# EAGLE design PlatingBoard (EAGLE 7.3.0)
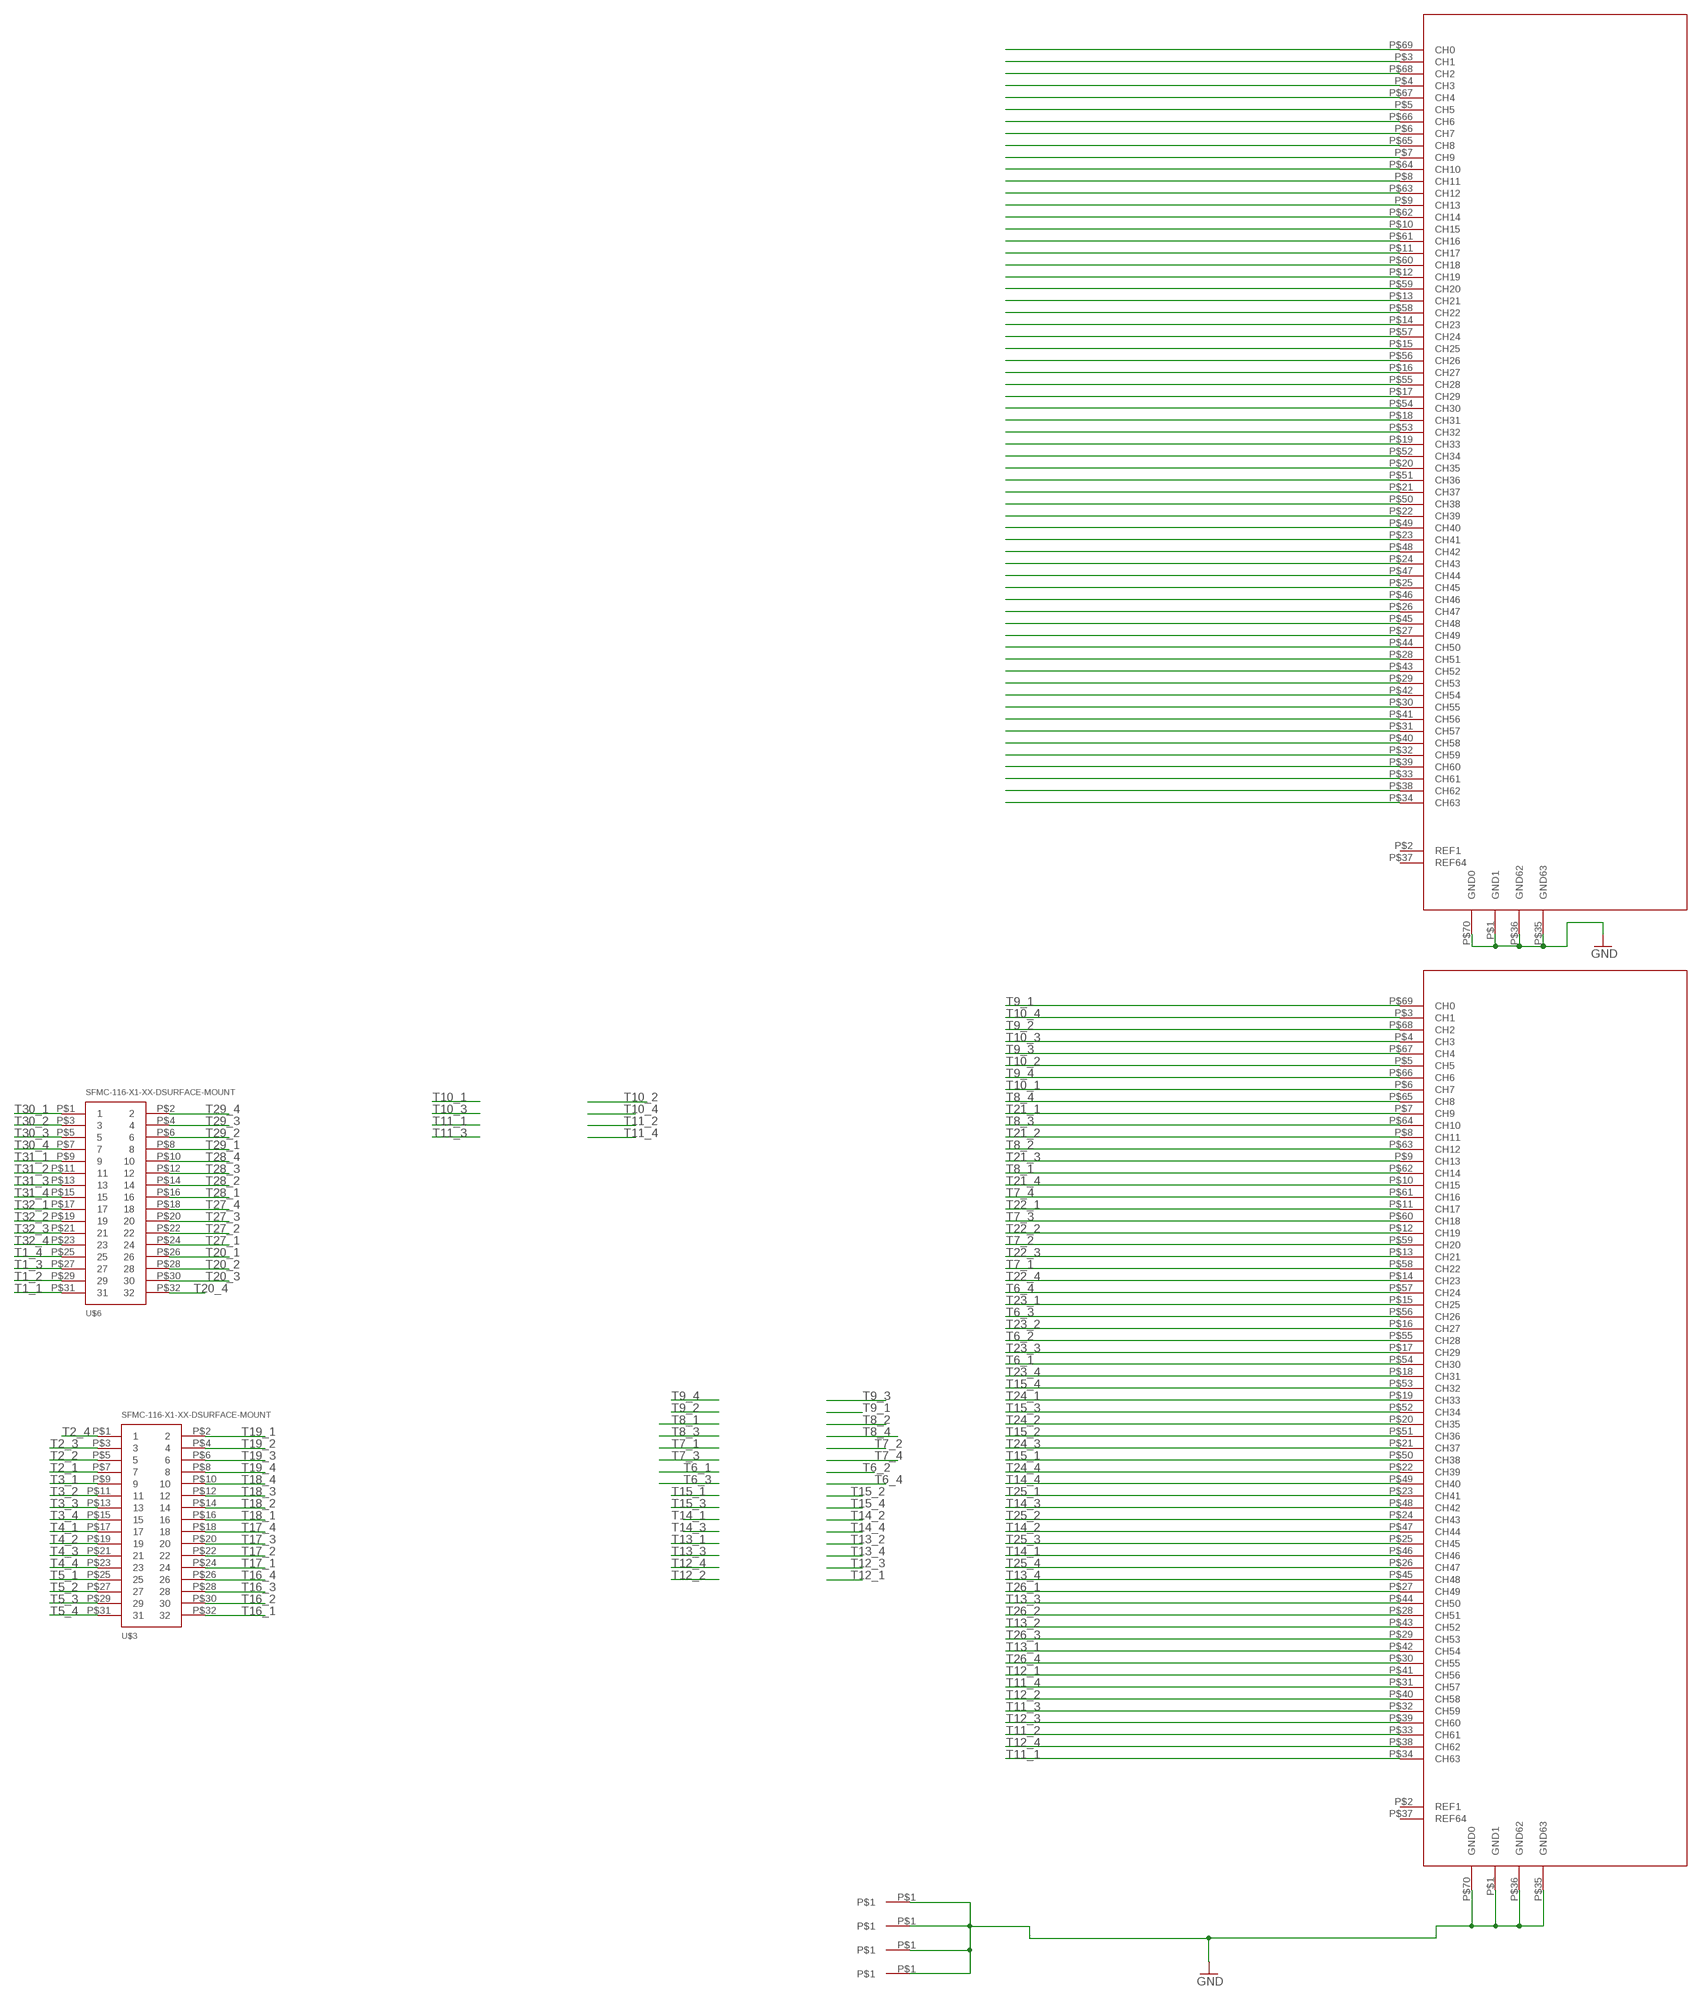
[diagram p0: schematic, sheet 1]

## Parts
U$1  TARRAYSHUTTLEHOLE  [TARRAYSHUTTLEHOLE]
U$2  TARRAYSHUTTLEHOLE  [TARRAYSHUTTLEHOLE]
U$3  SFMC-116-X1-XX-DSURFACE-MOUNT  [SFMC-116-X2-XX-D]
U$4  TARRAYSHUTTLEHOLE  [TARRAYSHUTTLEHOLE]
U$5  TARRAYSHUTTLEHOLE  [TARRAYSHUTTLEHOLE]
U$6  SFMC-116-X1-XX-DSURFACE-MOUNT  [SFMC-116-X2-XX-D]
U$11  HIROSE-70PIN-RECEPTACLE  [DF40HC-70DS-0.4V]
U$13  HIROSE-70PIN-RECEPTACLE  [DF40HC-70DS-0.4V]

## Nets
GND: U$1.P$1 U$2.P$1 U$4.P$1 U$5.P$1 U$11.P$1(GND1) U$11.P$35(GND63) U$11.P$36(GND62) U$11.P$70(GND0) U$13.P$1(GND1) U$13.P$35(GND63) U$13.P$36(GND62) U$13.P$70(GND0)
T1_1: U$6.P$31 U$11.P$34(CH63)
T1_2: U$6.P$29 U$11.P$33(CH61)
T1_3: U$6.P$27 U$11.P$32(CH59)
T1_4: U$6.P$25 U$11.P$31(CH57)
T2_1: U$3.P$7 U$11.P$41(CH56)
T2_2: U$3.P$5 U$11.P$40(CH58)
T2_3: U$3.P$3 U$11.P$39(CH60)
T2_4: U$3.P$1 U$11.P$38(CH62)
T3_1: U$3.P$9 U$11.P$42(CH54)
T3_2: U$3.P$11 U$11.P$43(CH52)
T3_3: U$3.P$13 U$11.P$44(CH50)
T3_4: U$3.P$15 U$11.P$45(CH48)
T4_1: U$3.P$17 U$11.P$46(CH46)
T4_2: U$3.P$19 U$11.P$47(CH44)
T4_3: U$3.P$21 U$11.P$48(CH42)
T4_4: U$3.P$23 U$11.P$49(CH40)
T5_1: U$3.P$25 U$11.P$50(CH38)
T5_2: U$3.P$27 U$11.P$51(CH36)
T5_3: U$3.P$29 U$11.P$52(CH34)
T5_4: U$3.P$31 U$11.P$53(CH32)
T6_1: U$13.P$54(CH30)
T6_2: U$13.P$55(CH28)
T6_3: U$13.P$56(CH26)
T6_4: U$13.P$57(CH24)
T7_1: U$13.P$58(CH22)
T7_2: U$13.P$59(CH20)
T7_3: U$13.P$60(CH18)
T7_4: U$13.P$61(CH16)
T8_1: U$13.P$62(CH14)
T8_2: U$13.P$63(CH12)
T8_3: U$13.P$64(CH10)
T8_4: U$13.P$65(CH8)
T9_1: U$13.P$69(CH0)
T9_2: U$13.P$68(CH2)
T9_3: U$13.P$67(CH4)
T9_4: U$13.P$66(CH6)
T10_1: U$13.P$6(CH7)
T10_2: U$13.P$5(CH5)
T10_3: U$13.P$4(CH3)
T10_4: U$13.P$3(CH1)
T11_1: U$13.P$34(CH63)
T11_2: U$13.P$33(CH61)
T11_3: U$13.P$32(CH59)
T11_4: U$13.P$31(CH57)
T12_1: U$13.P$41(CH56)
T12_2: U$13.P$40(CH58)
T12_3: U$13.P$39(CH60)
T12_4: U$13.P$38(CH62)
T13_1: U$13.P$42(CH54)
T13_2: U$13.P$43(CH52)
T13_3: U$13.P$44(CH50)
T13_4: U$13.P$45(CH48)
T14_1: U$13.P$46(CH46)
T14_2: U$13.P$47(CH44)
T14_3: U$13.P$48(CH42)
T14_4: U$13.P$49(CH40)
T15_1: U$13.P$50(CH38)
T15_2: U$13.P$51(CH36)
T15_3: U$13.P$52(CH34)
T15_4: U$13.P$53(CH32)
T16_1: U$3.P$32 U$11.P$54(CH30)
T16_2: U$3.P$30 U$11.P$55(CH28)
T16_3: U$3.P$28 U$11.P$56(CH26)
T16_4: U$3.P$26 U$11.P$57(CH24)
T17_1: U$3.P$24 U$11.P$58(CH22)
T17_2: U$3.P$22 U$11.P$59(CH20)
T17_3: U$3.P$20 U$11.P$60(CH18)
T17_4: U$3.P$18 U$11.P$61(CH16)
T18_1: U$3.P$16 U$11.P$62(CH14)
T18_2: U$3.P$14 U$11.P$63(CH12)
T18_3: U$3.P$12 U$11.P$64(CH10)
T18_4: U$3.P$10 U$11.P$65(CH8)
T19_1: U$3.P$2 U$11.P$69(CH0)
T19_2: U$3.P$4 U$11.P$68(CH2)
T19_3: U$3.P$6 U$11.P$67(CH4)
T19_4: U$3.P$8 U$11.P$66(CH6)
T20_1: U$6.P$26 U$11.P$6(CH7)
T20_2: U$6.P$28 U$11.P$5(CH5)
T20_3: U$6.P$30 U$11.P$4(CH3)
T20_4: U$6.P$32 U$11.P$3(CH1)
T21_1: U$13.P$7(CH9)
T21_2: U$13.P$8(CH11)
T21_3: U$13.P$9(CH13)
T21_4: U$13.P$10(CH15)
T22_1: U$13.P$11(CH17)
T22_2: U$13.P$12(CH19)
T22_3: U$13.P$13(CH21)
T22_4: U$13.P$14(CH23)
T23_1: U$13.P$15(CH25)
T23_2: U$13.P$16(CH27)
T23_3: U$13.P$17(CH29)
T23_4: U$13.P$18(CH31)
T24_1: U$13.P$19(CH33)
T24_2: U$13.P$20(CH35)
T24_3: U$13.P$21(CH37)
T24_4: U$13.P$22(CH39)
T25_1: U$13.P$23(CH41)
T25_2: U$13.P$24(CH43)
T25_3: U$13.P$25(CH45)
T25_4: U$13.P$26(CH47)
T26_1: U$13.P$27(CH49)
T26_2: U$13.P$28(CH51)
T26_3: U$13.P$29(CH53)
T26_4: U$13.P$30(CH55)
T27_1: U$6.P$24 U$11.P$7(CH9)
T27_2: U$6.P$22 U$11.P$8(CH11)
T27_3: U$6.P$20 U$11.P$9(CH13)
T27_4: U$6.P$18 U$11.P$10(CH15)
T28_1: U$6.P$16 U$11.P$11(CH17)
T28_2: U$6.P$14 U$11.P$12(CH19)
T28_3: U$6.P$12 U$11.P$13(CH21)
T28_4: U$6.P$10 U$11.P$14(CH23)
T29_1: U$6.P$8 U$11.P$15(CH25)
T29_2: U$6.P$6 U$11.P$16(CH27)
T29_3: U$6.P$4 U$11.P$17(CH29)
T29_4: U$6.P$2 U$11.P$18(CH31)
T30_1: U$6.P$1 U$11.P$19(CH33)
T30_2: U$6.P$3 U$11.P$20(CH35)
T30_3: U$6.P$5 U$11.P$21(CH37)
T30_4: U$6.P$7 U$11.P$22(CH39)
T31_1: U$6.P$9 U$11.P$23(CH41)
T31_2: U$6.P$11 U$11.P$24(CH43)
T31_3: U$6.P$13 U$11.P$25(CH45)
T31_4: U$6.P$15 U$11.P$26(CH47)
T32_1: U$6.P$17 U$11.P$27(CH49)
T32_2: U$6.P$19 U$11.P$28(CH51)
T32_3: U$6.P$21 U$11.P$29(CH53)
T32_4: U$6.P$23 U$11.P$30(CH55)
Unconnected: U$11.P$2(REF1) U$11.P$37(REF64) U$13.P$2(REF1) U$13.P$37(REF64)

## Library data of the parts
U$1 U$2 U$4 U$5 = UsefulConnectors:TARRAYSHUTTLEHOLE
U$3 U$6 = UsefulConnectors:SFMC-116-X1-XX-D
U$11 U$13 = UsefulConnectors:HIROSE-70PIN-RECEPTACLE

## Board
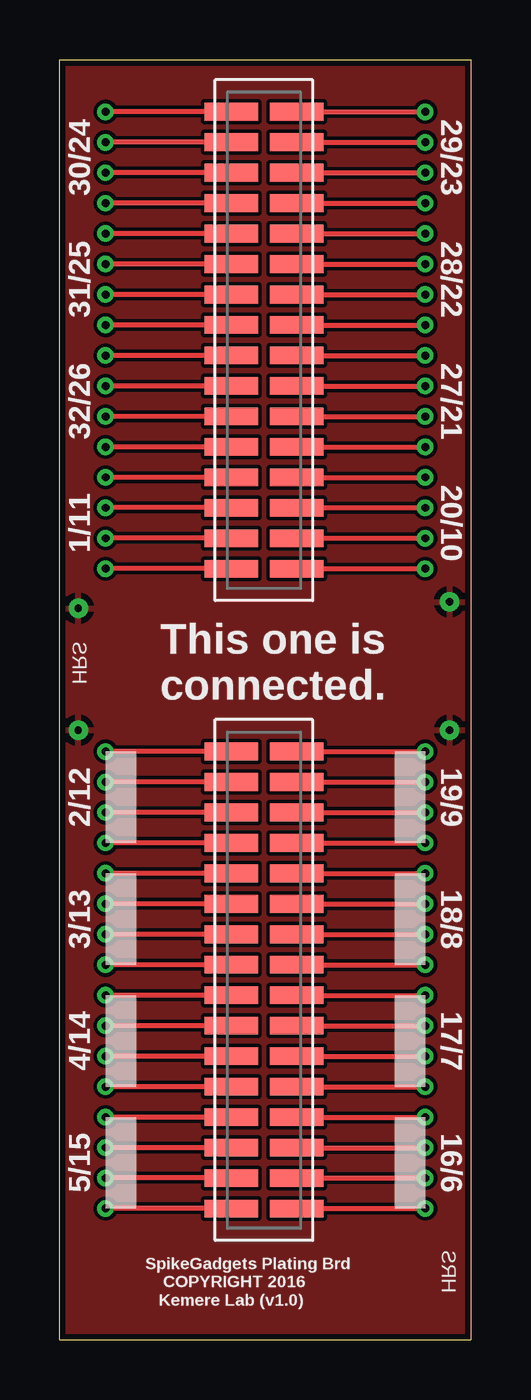
[diagram p1: board, top side]
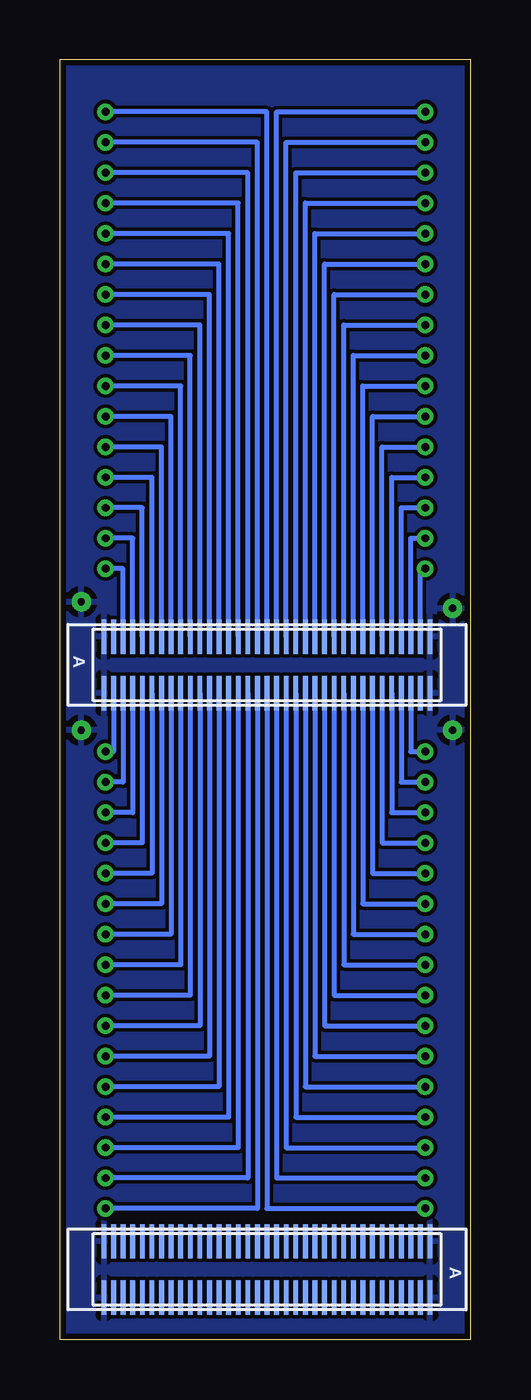
[diagram p2: board, bottom side, seen from below]

Size 17.14 x 53.34 mm. Coordinates in mm from the lower left corner, seen from the top.
Outline: 0,0 0,53.34 17.14,53.34 17.14,0 0,0
Copper layers (1*16): Top 0.035mm / dielectric 1.5mm / Bottom 0.035mm
Design rules "Seeed_DRU *": minimum track width 6mil, minimum drill 12mil, track to track 6mil, track to pad 6mil, pad to pad 6mil, via to via 6mil, smd to smd 0mil, copper to edge 10mil, drill to drill 10mil, minimum pad ring 10mil, minimum via ring 7mil, stop-mask expansion 2mil, vias tented up to drill 100mil, thermal gap 10mil

### Footprints (pad centres in the part's own frame; a part is rotated, then mirrored left to right if it is on the bottom)
TARRAYSHUTTLEHOLE = drill 0.305: P$1 0,0
SFMC-116-X2-XX-D = smd 0.737 x 2.223: P$1 9.525,1.365; P$2 9.525,-1.365; P$3 8.255,1.365; P$4 8.255,-1.365; P$5 6.985,1.365; P$6 6.985,-1.365; P$7 5.715,1.365; P$8 5.715,-1.365; P$9 4.445,1.365; P$10 4.445,-1.365; P$11 3.175,1.365; P$12 3.175,-1.365; P$13 1.905,1.365; P$14 1.905,-1.365; P$15 0.635,1.365; P$16 0.635,-1.365; P$17 -0.635,1.365; P$18 -0.635,-1.365; P$19 -1.905,1.365; P$20 -1.905,-1.365; P$21 -3.175,1.365; P$22 -3.175,-1.365; P$23 -4.445,1.365; P$24 -4.445,-1.365; P$25 -5.715,1.365; P$26 -5.715,-1.365; P$27 -6.985,1.365; P$28 -6.985,-1.365; P$29 -8.255,1.365; P$30 -8.255,-1.365; P$31 -9.525,1.365; P$32 -9.525,-1.365
DF40HC-70DS-0.4V = smd 0.2 x 1.43: P$1 -6.8,1.175; P$2 -6.4,1.175; P$3 -6,1.175; P$4 -5.6,1.175; P$5 -5.2,1.175; P$6 -4.8,1.175; P$7 -4.4,1.175; P$8 -4,1.175; P$9 -3.6,1.175; P$10 -3.2,1.175; P$11 -2.8,1.175; P$12 -2.4,1.175; P$13 -2,1.175; P$14 -1.6,1.175; P$15 -1.2,1.175; P$16 -0.8,1.175; P$17 -0.4,1.175; P$18 0,1.175; P$19 0.4,1.175; P$20 0.8,1.175; P$21 1.2,1.175; P$22 1.6,1.175; P$23 2,1.175; P$24 2.4,1.175; P$25 2.8,1.175; P$26 3.2,1.175; P$27 3.6,1.175; P$28 4,1.175; P$29 4.4,1.175; P$30 4.8,1.175; P$31 5.2,1.175; P$32 5.6,1.175; P$33 6,1.175; P$34 6.4,1.175; P$35 6.8,1.175; P$36 6.8,-1.175; P$37 6.4,-1.175; P$38 6,-1.175; P$39 5.6,-1.175; P$40 5.2,-1.175; P$41 4.8,-1.175; P$42 4.4,-1.175; P$43 4,-1.175; P$44 3.6,-1.175; P$45 3.2,-1.175; P$46 2.8,-1.175; P$47 2.4,-1.175; P$48 2,-1.175; P$49 1.6,-1.175; P$50 1.2,-1.175; P$51 0.8,-1.175; P$52 0.4,-1.175; P$53 0,-1.175; P$54 -0.4,-1.175; P$55 -0.8,-1.175; P$56 -1.2,-1.175; P$57 -1.6,-1.175; P$58 -2,-1.175; P$59 -2.4,-1.175; P$60 -2.8,-1.175; P$61 -3.2,-1.175; P$62 -3.6,-1.175; P$63 -4,-1.175; P$64 -4.4,-1.175; P$65 -4.8,-1.175; P$66 -5.2,-1.175; P$67 -5.6,-1.175; P$68 -6,-1.175; P$69 -6.4,-1.175; P$70 -6.8,-1.175

### Placement (x,y rotation side)
U$1  16.26,25.4 45 top
U$2  0.76,25.4 45 top
U$3  8.51,14.99 90 top
U$4  16.26,30.75 45 top
U$5  0.76,30.48 45 top
U$6  8.51,41.66 90 top
U$11  8.51,28.12 0 bottom
U$13  8.51,2.92 180 bottom

### Tracks (layer width: path | path; a pad name or v marks a point on that pad's centre or on a via)
GND
  pour Bottom: 0,0 17.02,0 17.02,53.47 0,53.47
  pour Top: 0,0 17.02,0 17.02,53.47 0,53.47
T1_1  (via drill 0.33)
  Top 0.203: U$6.P$31 v1.91,32.13
  Bottom 0.203: U$11.P$34 2.11,32.13 v1.91,32.13
T1_2  (via drill 0.33)
  Top 0.203: U$6.P$29 v1.91,33.4
  Bottom 0.203: U$11.P$33 2.51,33.4 v1.91,33.4
T1_3  (via drill 0.33)
  Top 0.203: U$6.P$27 v1.91,34.67
  Bottom 0.203: U$11.P$32 2.91,34.67 v1.91,34.67
T1_4  (via drill 0.33)
  Top 0.203: U$6.P$25 v1.91,35.94
  Bottom 0.203: U$11.P$31 3.31,35.94 v1.91,35.94
T2_1  (via drill 0.33)
  Top 0.203: U$3.P$7 v1.91,20.7
  Bottom 0.203: U$11.P$41 3.71,20.7 v1.91,20.7
T2_2  (via drill 0.33)
  Top 0.203: U$3.P$5 v1.91,21.97
  Bottom 0.203: U$11.P$40 3.31,21.97 v1.91,21.97
T2_3  (via drill 0.33)
  Top 0.203: U$3.P$3 v1.91,23.24
  Bottom 0.203: U$11.P$39 2.91,23.24 v1.91,23.24
T2_4  (via drill 0.33)
  Top 0.203: U$3.P$1 v1.91,24.51
  Bottom 0.203: U$11.P$38 2.51,24.51 v1.91,24.51
T3_1  (via drill 0.33)
  Top 0.203: U$3.P$9 v1.91,19.43
  Bottom 0.203: U$11.P$42 4.11,19.43 v1.91,19.43
T3_2  (via drill 0.33)
  Top 0.203: U$3.P$11 v1.91,18.16
  Bottom 0.203: U$11.P$43 4.51,18.16 v1.91,18.16
T3_3  (via drill 0.33)
  Top 0.203: U$3.P$13 v1.91,16.89
  Bottom 0.203: U$11.P$44 4.91,16.89 v1.91,16.89
T3_4  (via drill 0.33)
  Top 0.203: U$3.P$15 v1.91,15.62
  Bottom 0.203: U$11.P$45 5.31,15.62 v1.91,15.62
T4_1  (via drill 0.33)
  Top 0.203: U$3.P$17 v1.91,14.35
  Bottom 0.203: U$11.P$46 5.71,14.35 v1.91,14.35
T4_2  (via drill 0.33)
  Top 0.203: U$3.P$19 v1.91,13.08
  Bottom 0.203: U$11.P$47 6.11,13.08 v1.91,13.08
T4_3  (via drill 0.33)
  Top 0.203: U$3.P$21 v1.91,11.81
  Bottom 0.203: U$11.P$48 6.51,11.81 v1.91,11.81
T4_4  (via drill 0.33)
  Top 0.203: U$3.P$23 v1.91,10.54
  Bottom 0.203: U$11.P$49 6.91,10.54 v1.91,10.54
T5_1  (via drill 0.33)
  Top 0.203: U$3.P$25 v1.91,9.27
  Bottom 0.203: U$11.P$50 7.31,9.27 v1.91,9.27
T5_2  (via drill 0.33)
  Top 0.203: U$3.P$27 v1.91,8
  Bottom 0.203: U$11.P$51 7.71,8 v1.91,8
T5_3  (via drill 0.33)
  Top 0.203: U$3.P$29 v1.91,6.73
  Bottom 0.203: U$11.P$52 8.11,6.73 v1.91,6.73
T5_4  (via drill 0.33)
  Top 0.203: U$3.P$31 v1.91,5.46
  Bottom 0.203: U$11.P$53 8.51,5.46 v1.91,5.46
T16_1  (via drill 0.33)
  Top 0.203: U$3.P$32 v15.24,5.46
  Bottom 0.203: U$11.P$54 8.91,5.46 v15.24,5.46
T16_2  (via drill 0.33)
  Top 0.203: U$3.P$30 v15.24,6.73
  Bottom 0.203: U$11.P$55 9.31,6.73 v15.24,6.73
T16_3  (via drill 0.33)
  Top 0.203: U$3.P$28 v15.24,8
  Bottom 0.203: U$11.P$56 9.71,8 v15.24,8
T16_4  (via drill 0.33)
  Top 0.203: U$3.P$26 v15.24,9.27
  Bottom 0.203: U$11.P$57 10.11,9.27 v15.24,9.27
T17_1  (via drill 0.33)
  Top 0.203: U$3.P$24 v15.24,10.54
  Bottom 0.203: U$11.P$58 10.51,10.54 v15.24,10.54
T17_2  (via drill 0.33)
  Top 0.203: U$3.P$22 v15.24,11.81
  Bottom 0.203: U$11.P$59 10.91,11.81 v15.24,11.81
T17_3  (via drill 0.33)
  Top 0.203: U$3.P$20 v15.24,13.08
  Bottom 0.203: U$11.P$60 11.31,13.08 v15.24,13.08
T17_4  (via drill 0.33)
  Top 0.203: U$3.P$18 v15.24,14.35
  Bottom 0.203: U$11.P$61 11.71,14.35 v15.24,14.35
T18_1  (via drill 0.33)
  Top 0.203: U$3.P$16 v15.24,15.62
  Bottom 0.203: U$11.P$62 12.11,15.62 v15.24,15.62
T18_2  (via drill 0.33)
  Top 0.203: U$3.P$14 v15.24,16.89
  Bottom 0.203: U$11.P$63 12.51,16.89 v15.24,16.89
T18_3  (via drill 0.33)
  Top 0.203: U$3.P$12 v15.24,18.16
  Bottom 0.203: U$11.P$64 12.91,18.16 v15.24,18.16
T18_4  (via drill 0.33)
  Top 0.203: U$3.P$10 v15.24,19.43
  Bottom 0.203: U$11.P$65 13.31,19.43 v15.24,19.43
T19_1  (via drill 0.33)
  Top 0.203: U$3.P$2 v15.24,24.51
  Bottom 0.203: U$11.P$69 14.91,24.51 v15.24,24.51
T19_2  (via drill 0.33)
  Top 0.203: U$3.P$4 v15.24,23.24
  Bottom 0.203: U$11.P$68 14.51,23.24 v15.24,23.24
T19_3  (via drill 0.33)
  Top 0.203: U$3.P$6 v15.24,21.97
  Bottom 0.203: U$11.P$67 14.11,21.97 v15.24,21.97
T19_4  (via drill 0.33)
  Top 0.203: U$3.P$8 v15.24,20.7
  Bottom 0.203: U$11.P$66 13.71,20.7 v15.24,20.7
T20_1  (via drill 0.33)
  Top 0.203: U$6.P$26 v15.24,35.94
  Bottom 0.203: U$11.P$6 13.31,35.94 v15.24,35.94
T20_2  (via drill 0.33)
  Top 0.203: U$6.P$28 v15.24,34.67
  Bottom 0.203: U$11.P$5 13.71,34.67 v15.24,34.67
T20_3  (via drill 0.33)
  Top 0.203: U$6.P$30 v15.24,33.4
  Bottom 0.203: U$11.P$4 14.11,33.4 v15.24,33.4
T20_4  (via drill 0.33)
  Top 0.203: U$6.P$32 v15.24,32.13
  Bottom 0.203: U$11.P$3 14.51,32.13 v15.24,32.13
T27_1  (via drill 0.33)
  Top 0.203: U$6.P$24 v15.24,37.21
  Bottom 0.203: U$11.P$7 12.91,37.21 v15.24,37.21
T27_2  (via drill 0.33)
  Top 0.203: U$6.P$22 v15.24,38.48
  Bottom 0.203: U$11.P$8 12.51,38.48 v15.24,38.48
T27_3  (via drill 0.33)
  Top 0.203: U$6.P$20 v15.24,39.75
  Bottom 0.203: U$11.P$9 12.11,39.75 v15.24,39.75
T27_4  (via drill 0.33)
  Top 0.203: U$6.P$18 v15.24,41.02
  Bottom 0.203: U$11.P$10 11.71,41.02 v15.24,41.02
T28_1  (via drill 0.33)
  Top 0.203: U$6.P$16 v15.24,42.29
  Bottom 0.203: U$11.P$11 11.31,42.29 v15.24,42.29
T28_2  (via drill 0.33)
  Top 0.203: U$6.P$14 v15.24,43.56
  Bottom 0.203: U$11.P$12 10.91,43.56 v15.24,43.56
T28_3  (via drill 0.33)
  Top 0.203: U$6.P$12 v15.24,44.83
  Bottom 0.203: U$11.P$13 10.51,44.83 v15.24,44.83
T28_4  (via drill 0.33)
  Top 0.203: U$6.P$10 v15.24,46.1
  Bottom 0.203: U$11.P$14 10.11,46.1 v15.24,46.1
T29_1  (via drill 0.33)
  Top 0.203: U$6.P$8 v15.24,47.37
  Bottom 0.203: U$11.P$15 9.71,47.37 v15.24,47.37
T29_2  (via drill 0.33)
  Top 0.203: U$6.P$6 v15.24,48.64
  Bottom 0.203: U$11.P$16 9.31,48.64 v15.24,48.64
T29_3  (via drill 0.33)
  Top 0.203: U$6.P$4 v15.24,49.91
  Bottom 0.203: U$11.P$17 8.91,49.91 v15.24,49.91
T29_4  (via drill 0.33)
  Top 0.203: U$6.P$2 v15.24,51.18
  Bottom 0.203: U$11.P$18 8.51,51.18 v15.24,51.18
T30_1  (via drill 0.33)
  Top 0.203: U$6.P$1 v1.91,51.18
  Bottom 0.203: U$11.P$19 8.11,51.18 v1.91,51.18
T30_2  (via drill 0.33)
  Top 0.203: U$6.P$3 v1.91,49.91
  Bottom 0.203: U$11.P$20 7.71,49.91 v1.91,49.91
T30_3  (via drill 0.33)
  Top 0.203: U$6.P$5 v1.91,48.64
  Bottom 0.203: U$11.P$21 7.31,48.64 v1.91,48.64
T30_4  (via drill 0.33)
  Top 0.203: U$6.P$7 v1.91,47.37
  Bottom 0.203: U$11.P$22 6.91,47.37 v1.91,47.37
T31_1  (via drill 0.33)
  Top 0.203: U$6.P$9 v1.91,46.1
  Bottom 0.203: U$11.P$23 6.51,46.1 v1.91,46.1
T31_2  (via drill 0.33)
  Top 0.203: U$6.P$11 v1.91,44.83
  Bottom 0.203: U$11.P$24 6.11,44.83 v1.91,44.83
T31_3  (via drill 0.33)
  Top 0.203: U$6.P$13 v1.91,43.56
  Bottom 0.203: U$11.P$25 5.71,43.56 v1.91,43.56
T31_4  (via drill 0.33)
  Top 0.203: U$6.P$15 v1.91,42.29
  Bottom 0.203: U$11.P$26 5.31,42.29 v1.91,42.29
T32_1  (via drill 0.33)
  Top 0.203: U$6.P$17 v1.91,41.02
  Bottom 0.203: U$11.P$27 4.91,41.02 v1.91,41.02
T32_2  (via drill 0.33)
  Top 0.203: U$6.P$19 v1.91,39.75
  Bottom 0.203: U$11.P$28 4.51,39.75 v1.91,39.75
T32_3  (via drill 0.33)
  Top 0.203: U$6.P$21 v1.91,38.48
  Bottom 0.203: U$11.P$29 4.11,38.48 v1.91,38.48
T32_4  (via drill 0.33)
  Top 0.203: U$6.P$23 v1.91,37.21
  Bottom 0.203: U$11.P$30 3.71,37.21 v1.91,37.21

### Text on the board
tPlace: 30/24 | 29/23 | 31/25 | 28/22 | 32/26 | 27/21 | 1/11 | 20/10 | This one is / connected. | 2/12 | 19/9 | 3/13 | 18/8 | 4/14 | 17/7 | 5/15 | 16/6 | SpikeGadgets Plating Brd / COPYRIGHT 2016 / Kemere Lab (v1.0)